# Altium schematic sheet EtherNet.SchDoc
size A4; Revision: C.1(PCB.SCH)
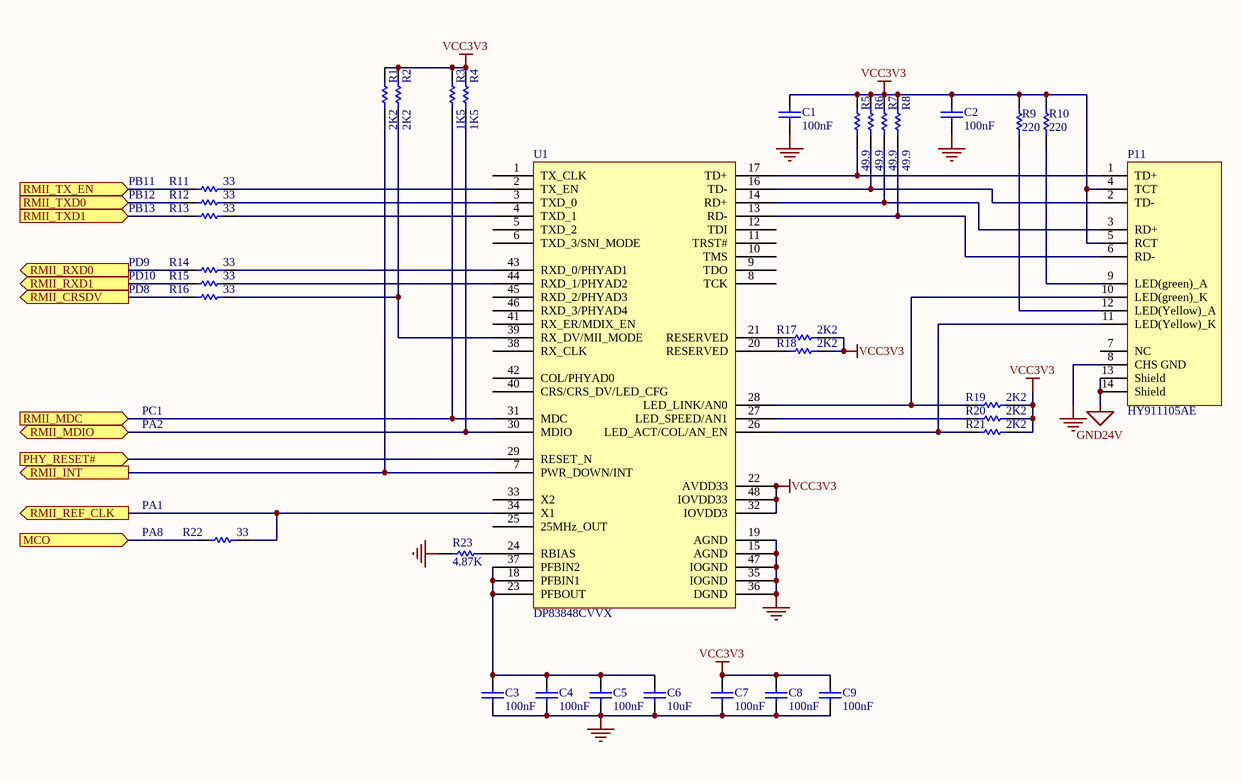
[diagram p0: EtherNet.SchDoc]

## Parts
C1  100nF  [0805_C]
C2  100nF  [0805_C]
C3  100nF  [0805_C]
C4  100nF  [0805_C]
C5  100nF  [0805_C]
C6  10uF  [0805_C]
C7  100nF  [0805_C]
C8  100nF  [0805_C]
C9  100nF  [0805_C]
P11  HY911105AE  [HANRUN-A8]
R1  2K2  [0805_R]
R2  2K2  [0805_R]
R3  1K5  [0805_R]
R4  1K5  [0805_R]
R5  49.9  [0805_R]
R6  49.9  [0805_R]
R7  49.9  [0805_R]
R8  49.9  [0805_R]
R9  220  [0805_R]
R10  220  [0805_R]
R11  33  [0805_R]
R12  33  [0805_R]
R13  33  [0805_R]
R14  33  [0805_R]
R15  33  [0805_R]
R16  33  [0805_R]
R17  2K2  [0805_R]
R18  2K2  [0805_R]
R19  2K2  [0805_R]
R20  2K2  [0805_R]
R21  2K2  [0805_R]
R22  33  [0805_R]
R23  4.87K  [0805_R]
U1  DP83848CVVX  [LQFP-48_7x7x05P]

## Ports
MCO (in), PHY_RESET# (in), RMII_CRSDV (out), RMII_INT (out), RMII_MDC (in), RMII_MDIO (bidir), RMII_REF_CLK (out), RMII_RXD0 (out), RMII_RXD1 (out), RMII_TX_EN (in), RMII_TXD0 (in), RMII_TXD1 (in)

## Nets
GND: C1.2 C2.2 C3.2 C4.2 C5.2 C6.1 C7.2 C8.2 C9.2 P11.8(CHS_GND) R23.1 U1.15(AGND) U1.19(AGND) U1.35(IOGND) U1.36(DGND) U1.47(IOGND)
GND24V: P11.13(Shield) P11.14(Shield)
VCC3V3: C1.1 C2.1 C7.1 C8.1 C9.1 P11.4(TCT) P11.5(RCT) R1.2 R2.2 R3.2 R4.2 R5.2 R6.2 R7.2 R8.2 R9.2 R10.2 R17.2 R18.2 R19.2 R20.2 R21.2 U1.22(AVDD33) U1.32(IOVDD3) U1.48(IOVDD33)
MCO: R22.2 ; port MCO
PHY_RESET#: U1.29(RESET_N) ; port PHY_RESET#
RMII_CRSDV: R16.2 ; port RMII_CRSDV
RMII_INT: R1.1 U1.7(PWR_DOWN/INT) ; port RMII_INT
RMII_MDC: R3.1 U1.31(MDC) ; port RMII_MDC
RMII_MDIO: R4.1 U1.30(MDIO) ; port RMII_MDIO
RMII_REF_CLK: R22.1 U1.34(X1) ; port RMII_REF_CLK
RMII_RXD0: R14.2 ; port RMII_RXD0
RMII_RXD1: R15.2 ; port RMII_RXD1
RMII_TX_EN: R11.2 ; port RMII_TX_EN
RMII_TXD0: R12.2 ; port RMII_TXD0
RMII_TXD1: R13.2 ; port RMII_TXD1
NetC3_1: C3.1 C4.1 C5.1 C6.2 U1.18(PFBIN1) U1.23(PFBOUT) U1.37(PFBIN2)
NetP11_1: P11.1(TD+) R5.1 U1.17(TD+)
NetP11_2: P11.2(TD-) R6.1 U1.16(TD-)
NetP11_3: P11.3(RD+) R7.1 U1.14(RD+)
NetP11_6: P11.6(RD-) R8.1 U1.13(RD-)
NetP11_9: P11.9(LED(green)_A) R10.1
NetP11_10: P11.10(LED(green)_K) R19.1 U1.28(LED_LINK/AN0)
NetP11_11: P11.11(LED(Yellow)_K) R21.1 U1.26(LED_ACT/COL/AN_EN)
NetP11_12: P11.12(LED(Yellow)_A) R9.1
NetR2_1: R2.1 R16.1 U1.39(RX_DV/MII_MODE)
NetR11_1: R11.1 U1.2(TX_EN)
NetR12_1: R12.1 U1.3(TXD_0)
NetR13_1: R13.1 U1.4(TXD_1)
NetR14_1: R14.1 U1.43(RXD_0/PHYAD1)
NetR15_1: R15.1 U1.44(RXD_1/PHYAD2)
NetR17_1: R17.1 U1.21(RESERVED)
NetR18_1: R18.1 U1.20(RESERVED)
NetR20_1: R20.1 U1.27(LED_SPEED/AN1)
NetR23_2: R23.2 U1.24(RBIAS)

Not connected (* = marked no-connect by the designer): P11 7(NC); U1 1(TX_CLK) 5(TXD_2) 6(TXD_3/SNI_MODE) 8(TCK) 9(TDO) 10(TMS) 11(TRST#) 12(TDI) 25(25MHz_OUT) 33(X2) 38(RX_CLK) 40(CRS/CRS_DV/LED_CFG) 41(RX_ER/MDIX_EN) 42(COL/PHYAD0) 45(RXD_2/PHYAD3) 46(RXD_3/PHYAD4)

## Notes on the sheet
- PB11
- PB12
- PB13
- PD9
- PD10
- PD8
- PC1
- PA2
- PA1
- (near R22) PA8
- Title
- Size:
- Date:
- A4
- Number:
- Time:
- Revision:
- Sheet
- of
- File:

## Library data of the parts
C1-C5 C7-C9 = 0805 100nF(104) 10% 50V: 贴片电容; ComponentLink1Description: 供应商链接; ComponentLink1URL: http://www.szlcsc.com/product/details_50686.html; Package: 0805; Supplier: LC; SuppliersPartNumber: C49678
C6 = 0805 10uF (106) 10% 25V: 贴片电容; ComponentLink1Description: 供应商链接; ComponentLink1URL: http://www.szlcsc.com/product/details_16532.html; Package: 0805; Supplier: LC; SuppliersPartNumber: C15850
P11 = J0011D21B
R1-R23 = Res1: Resistor; Value: 1K; Published: 8-Jun-2000; Revision: July-2002: Re-released for DXP Platform.; Publisher: Altium Limited
U1 = DP83848CVVX_[C16688]: 接口芯片; ComponentLink1Description: 供应商链接; ComponentLink1URL: http://www.szlcsc.com/product/details_17371.html; Package: LQFP-48_7x7x05P; Supplier: LC; SuppliersPartNumber: C16688